# EasyEDA schematic SCH_ArduinoNanoOPL3_2022-04-20.json
TITLE: Sheet_1; REV: 1.0; Date: 2022-04-16; Sheet: 1/1; Drawn By: zhblue; Company: Your Company
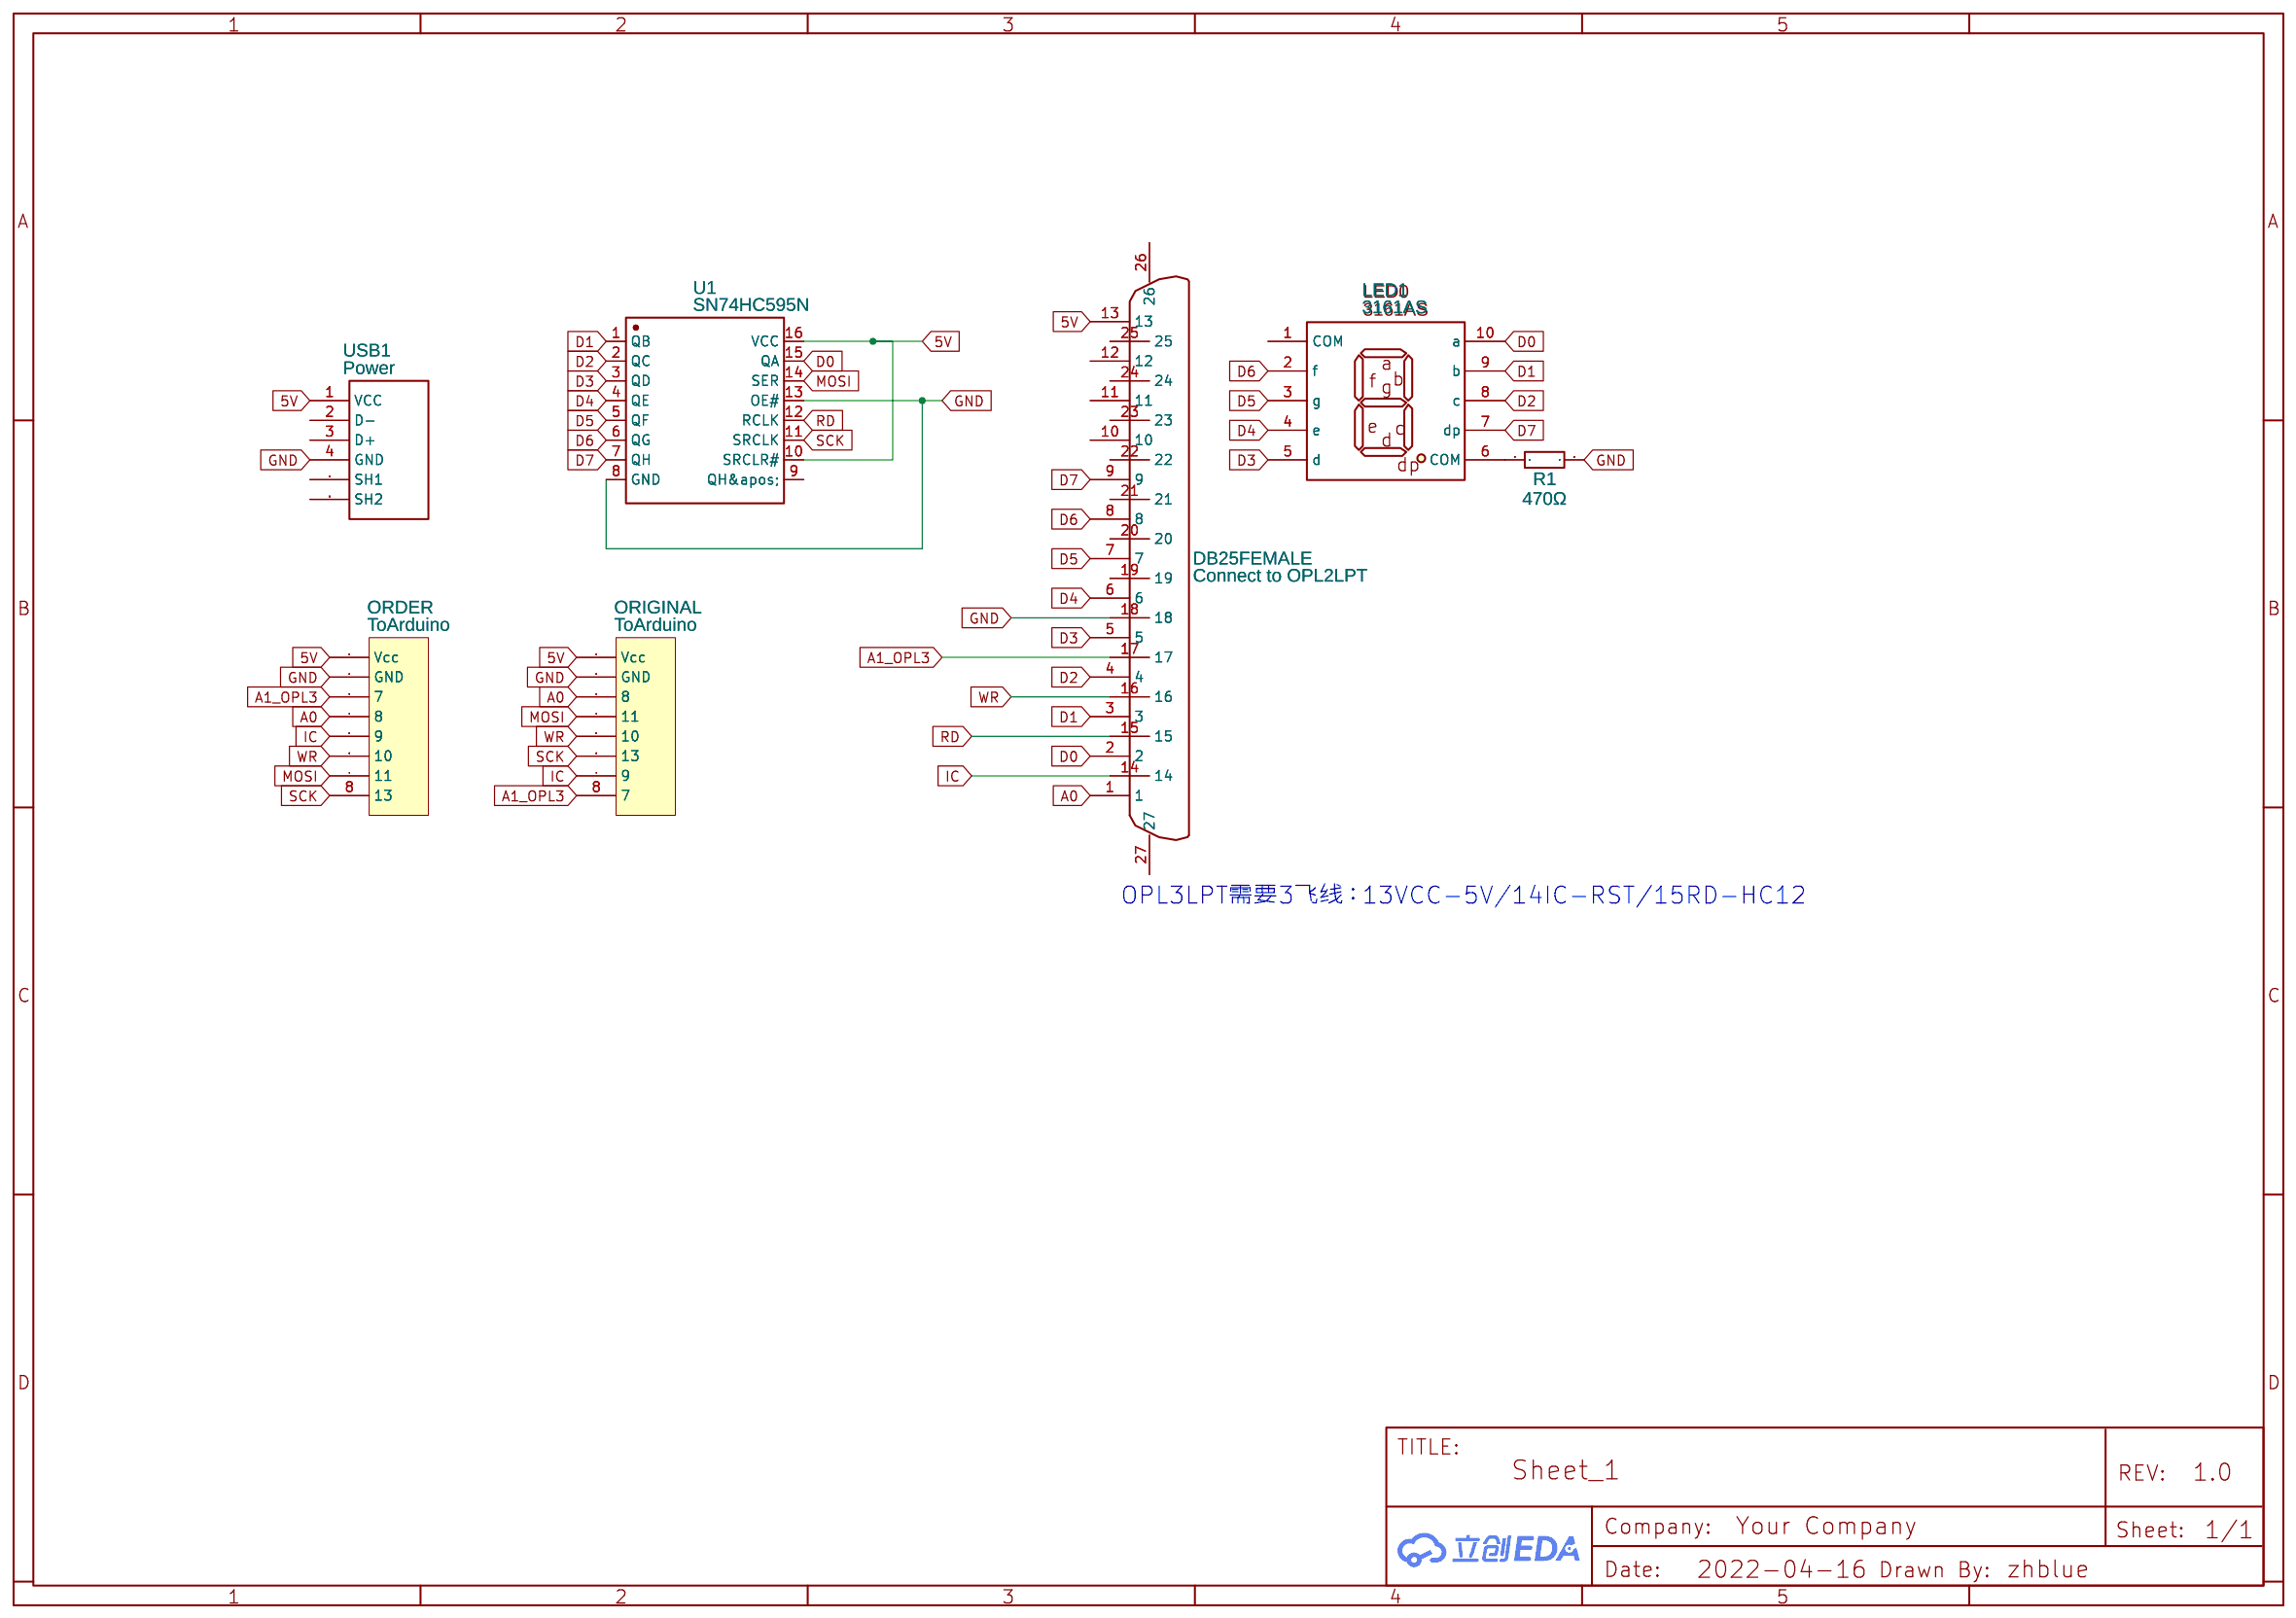
[diagram p0: schematic sheet]

## Parts
DB25FEMALE  Connect to OPL2LPT  [DB25-TH_FDB2503-F0DS300K6KF]
LED1  3161AS  [3161AS/BS]
ORDER  ToArduino  [HDR1X8]
ORIGINAL  ToArduino  [HDR1X8]
R1  470Ω  [R0603]
U1  SN74HC595N  [DIP-16_L19.8-W6.5-P2.54-LS7.6-BL]
USB1  Power  [USB-A-TH_USB-302-T]

## Library data of the parts
DB25FEMALE = FDB2503-F0DS300K6KF: Supplier: LCSC; Supplier Part: C2834383; Manufacturer: TXGA(特思嘉); Contributor: LCSC; JLCPCB Part Class: Extended Part
LED1 = 3161AS: Contributor: bh3nbx
ORDER ORIGINAL = 8P: Contributor: light-_-1321
R1 = QR0603F470RP05: Supplier: LCSC; Supplier Part: C176130; Manufacturer: Ever Ohms Tech; Resistance (Ohms): 470; Contributor: LCSC; JLCPCB Part Class: Extended Part
U1 = SN74HC595N: Supplier: LCSC; Manufacturer: TI; Supplier Part: C78711; JLCPCB Part Class: Extended Part
USB1 = U-USBAR04P-F000: Supplier: LCSC; Supplier Part: C386740; Manufacturer: Shenzhen Cankemeng; Contributor: LCSC; JLCPCB Part Class: Extended Part

## Nets
5V: DB25FEMALE.13 ORDER.1(Vcc) ORIGINAL.1(Vcc) U1.10(SRCLR#) U1.16(VCC) USB1.1(VCC)
GND: DB25FEMALE.18 ORDER.2(GND) ORIGINAL.2(GND) R1.2 U1.8(GND) U1.13(OE#) USB1.4(GND)
A0: DB25FEMALE.1 ORDER.4(8) ORIGINAL.3(8)
A1_OPL3: DB25FEMALE.17 ORDER.3(7) ORIGINAL.8(7)
D0: DB25FEMALE.2 LED1.10(a) U1.15(QA)
D1: DB25FEMALE.3 LED1.9(b) U1.1(QB)
D2: DB25FEMALE.4 LED1.8(c) U1.2(QC)
D3: DB25FEMALE.5 LED1.5(d) U1.3(QD)
D4: DB25FEMALE.6 LED1.4(e) U1.4(QE)
D5: DB25FEMALE.7 LED1.3(g) U1.5(QF)
D6: DB25FEMALE.8 LED1.2(f) U1.6(QG)
D7: DB25FEMALE.9 LED1.7(dp) U1.7(QH)
IC: DB25FEMALE.14 ORDER.5(9) ORIGINAL.7(9)
MOSI: ORDER.7(11) ORIGINAL.4(11) U1.14(SER)
RD: DB25FEMALE.15 U1.12(RCLK)
SCK: ORDER.8(13) ORIGINAL.6(13) U1.11(SRCLK)
WR: DB25FEMALE.16 ORDER.6(10) ORIGINAL.5(10)
Net-(LED1-6): LED1.6(COM) R1.1

Not connected (* = marked no-connect by the designer): DB25FEMALE 10 11 12 19 20 21 22 23 24 25 26 27; LED1 1(COM); U1 9(QH'); USB1 2(D-) 3(D+) 5(SH1) 6(SH2)

## Notes on the sheet
- OPL3LPT需要3飞线：13VCC-5V/14IC-RST/15RD-HC12
